# Altium schematic sheet [02] - RS232.SchDoc
size A4
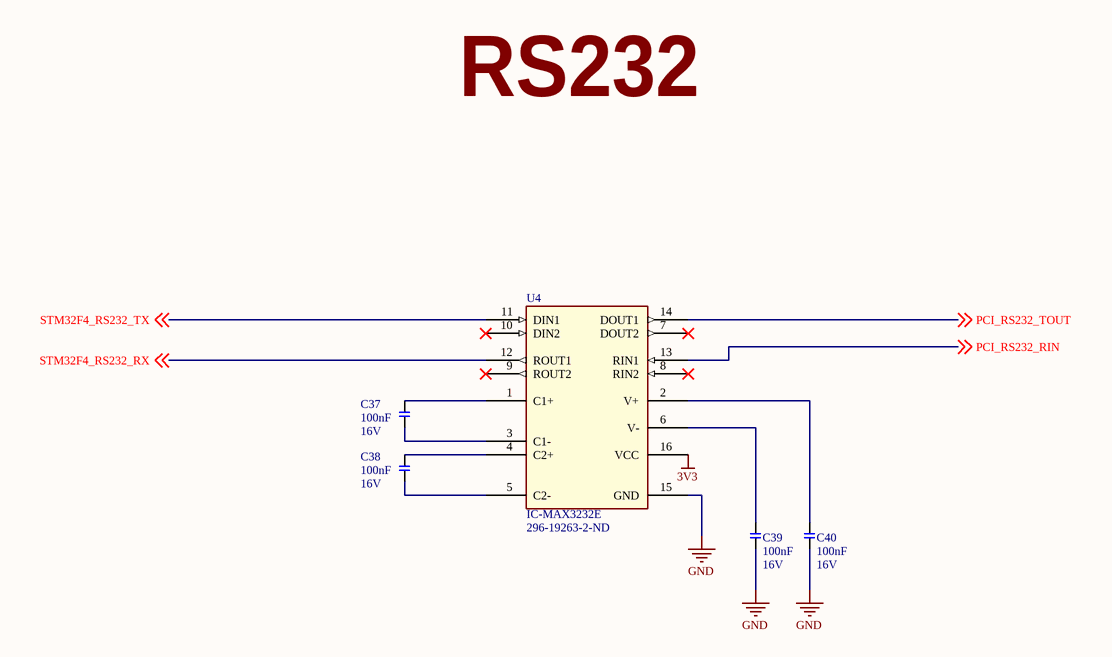
[diagram p0: [02] - RS232.SchDoc]

## Parts
C37  100nF  Voltage - Rated: 16V  [C0805]
C38  100nF  Voltage - Rated: 16V  [C0805]
C39  100nF  Voltage - Rated: 16V  [C0805]
C40  100nF  Voltage - Rated: 16V  [C0805]
U4  IC-MAX3232E  Supplier Part Number 1: 296-19263-2-ND  [TI-DW16_M]

## Nets
3V3: U4.16(VCC)
GND: C39.1 C40.1 U4.15(GND)
PCI_RS232_RIN: U4.13(RIN1) ; off-sheet PCI_RS232_RIN
PCI_RS232_TOUT: U4.14(DOUT1) ; off-sheet PCI_RS232_TOUT
STM32F4_RS232_RX: U4.12(ROUT1) ; off-sheet STM32F4_RS232_RX
STM32F4_RS232_TX: U4.11(DIN1) ; off-sheet STM32F4_RS232_TX
NetC37_1: C37.1 U4.3(C1-)
NetC37_2: C37.2 U4.1(C1+)
NetC38_1: C38.1 U4.5(C2-)
NetC38_2: C38.2 U4.4(C2+)
NetC39_2: C39.2 U4.6(V-)
NetC40_2: C40.2 U4.2(V+)

Not connected (* = marked no-connect by the designer): U4 7(DOUT2)* 8(RIN2)* 9(ROUT2)* 10(DIN2)*

## Notes on the sheet
- RS232

## Library data of the parts
C37-C40 = C-100NF,16V,0805: AVX - 0805YA103JAT2A - CAP, MLCC, C0G/NP0, 10NF, 16V, 0805; Tolerance: ±5%; Temperature Coefficient: C0G, NP0; Supplier 1: Digi-Key; Manufacturer: AVX; Manufacturer Part Number: 0805YA103JAT2A; RoHS: YES; Category: Capacitors; Stock 1: 28062; Pricing 1: 1=0.29, 10=0.204, 25=0.1668, 50=0.1424, 100=0.1221, 250=0.10176, 500=0.09158, 1000=0.07733 (USD); Packaging: Cut Tape (CT); Capacitance: 100nF; Mounting Type: Surface Mount, MLCC; Operating Temperature: -55°C ~ 125°C; Applications: General Purpose; Ratings: -; Package / Case: 0805 (2012 Metric); Size / Dimension: 0.079" L x 0.049" W (2.01mm x 1.25mm); Height - Seated (Max): -; Thickness (Max): 0.037" (0.94mm); Lead Spacing: -; Features: -; Lead Style: -; ComponentLink1URL: http://www.avx.com/docs/Catalogs/ccog.pdf; ComponentLink1Description: http://www.avx.com/docs/Catalogs/ccog.pdf; Supplier Part Number 1: 478-1334-1-ND; ComponentLink2URL: http://www.farnell.com/datasheets/1825494.pdf; ComponentLink2Description: http://www.farnell.com/datasheets/1825494.pdf; ComponentLink3URL: http://datasheets.avx.com/C0GNP0-Dielectric.pdf; ComponentLink3Description: http://datasheets.avx.com/C0GNP0-Dielectric.pdf
U4 = IC-MAX3232E: Dual Channel RS-232 Line Driver/Receiver; TIIntPartnumber: 1A0213; MfrNum: MAX3232ECD; Mfr: TI; Cost10K: 0.81; Cost100: 1.47; Vendor: Digikey; DescriptiveText: Dual Channel RS-232 Line Driver/Receiver; PartName: MAX3232E; Descriptive_Text: Dual Channel RS-232 Line Driver/Receiver; Supplier 1: Digi-Key